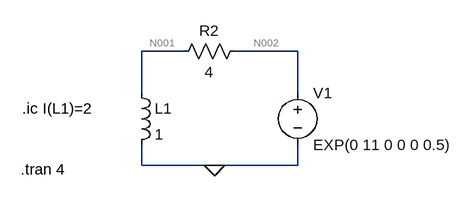
[diagram p0: schematic 19thoct(l-r-circuit).asc]
19thoct(l-r-circuit).asc, the LTspice schematic file:
Version 4
SHEET 1 880 680
WIRE 208 64 144 64
WIRE 384 64 288 64
WIRE 144 128 144 64
WIRE 384 128 384 64
WIRE 144 240 144 208
WIRE 256 240 144 240
WIRE 384 240 384 208
WIRE 384 240 256 240
FLAG 256 240 0
SYMBOL voltage 384 112 R0
WINDOW 123 0 0 Left 0
WINDOW 39 0 0 Left 0
SYMATTR InstName V1
SYMATTR Value EXP(0 11 0 0 0 0.5)
SYMBOL res 304 48 R90
WINDOW 0 0 56 VBottom 2
WINDOW 3 32 56 VTop 2
SYMATTR InstName R2
SYMATTR Value 4
SYMBOL ind 128 112 R0
SYMATTR InstName L1
SYMATTR Value 1
TEXT -40 152 Left 2 !.ic I(L1)=2
TEXT -42 246 Left 2 !.tran 4

The netlist it stands for:
* 19thoct(l-r-circuit).asc
V1 N002 0 EXP(0 11 0 0 0 0.5)
R2 N002 N001 4
L1 N001 0 1
.ic I(L1)=2
.tran 4
.backanno
.end

* Results of the author's LTspice run, read from the files saved beside the schematic
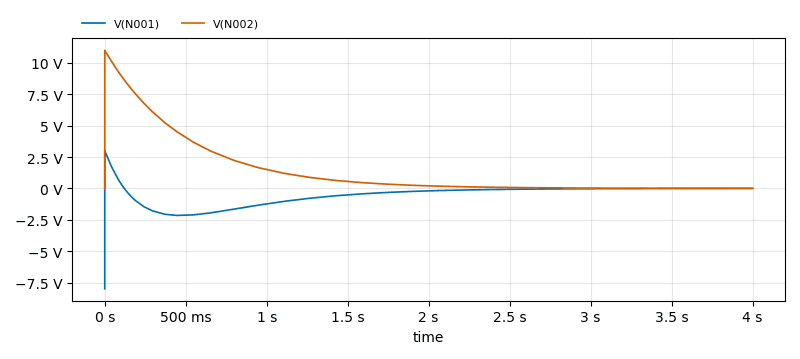
[diagram p1: Transient Analysis of 19thoct(l-r-circuit).asc, plotted from the saved traces]
* Transient Analysis, 1 run:
*   V(N001): min -8 V, max 2.997 V, average -498.2 mV, rms 926.7 mV, last -3.685 mV
*   V(N002): min 0 V, max 11 V, average 1.379 V, rms 2.758 V, last 3.69 mV